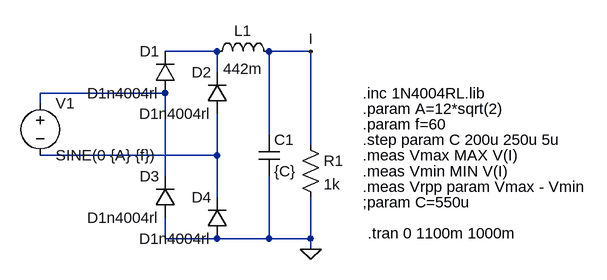
[diagram p0: schematic rectificador2_ondaCompleta.asc]
rectificador2_ondaCompleta.asc, the LTspice schematic file:
Version 4
SHEET 1 880 680
WIRE 192 -16 112 -16
WIRE 336 -16 272 -16
WIRE 192 16 192 -16
WIRE 112 48 -80 48
WIRE -80 64 -80 48
WIRE 272 112 272 -16
WIRE 336 128 336 -16
WIRE 192 144 192 80
WIRE 192 144 -80 144
WIRE 112 176 112 48
WIRE 192 208 192 144
WIRE 112 272 112 240
WIRE 192 272 112 272
WIRE 272 272 272 176
WIRE 272 272 192 272
WIRE 336 272 336 208
WIRE 336 272 272 272
WIRE 336 288 336 272
FLAG 336 288 0
FLAG 336 -16 I
SYMBOL diode 128 48 R180
WINDOW 0 24 64 Left 2
WINDOW 3 24 0 Left 2
SYMATTR InstName D1
SYMATTR Value D1n4004rl
SYMBOL voltage -80 48 R0
WINDOW 123 0 0 Left 0
WINDOW 39 0 0 Left 0
SYMATTR InstName V1
SYMATTR Value SINE(0 {A} {f})
SYMBOL cap 256 112 R0
SYMATTR InstName C1
SYMATTR Value {C}
SYMBOL res 320 112 R0
SYMATTR InstName R1
SYMATTR Value 1k
SYMBOL diode 208 80 R180
WINDOW 0 24 64 Left 2
WINDOW 3 24 0 Left 2
SYMATTR InstName D2
SYMATTR Value D1n4004rl
SYMBOL diode 128 240 R180
WINDOW 0 24 64 Left 2
WINDOW 3 24 0 Left 2
SYMATTR InstName D3
SYMATTR Value D1n4004rl
SYMBOL diode 208 272 R180
WINDOW 0 24 64 Left 2
WINDOW 3 24 0 Left 2
SYMATTR InstName D4
SYMATTR Value D1n4004rl
SYMBOL ind 176 0 R270
WINDOW 0 32 56 VTop 2
WINDOW 3 5 56 VBottom 2
SYMATTR InstName L1
SYMATTR Value 442m
TEXT 416 48 Left 2 !.inc 1N4004RL.lib
TEXT 416 72 Left 2 !.param A=12*sqrt(2)
TEXT 416 96 Left 2 !.param f=60
TEXT 416 120 Left 2 !.step param C 200u 250u 5u
TEXT 416 144 Left 2 !.meas Vmax MAX V(I)
TEXT 416 168 Left 2 !.meas Vmin MIN V(I)
TEXT 416 192 Left 2 !.meas Vrpp param Vmax - Vmin
TEXT 424 264 Left 2 !.tran 0 1100m 1000m
TEXT 416 216 Left 2 !;param C=550u

The netlist it stands for:
* rectificador2_ondaCompleta.asc
D1 N002 N001 D1n4004rl
V1 N002 N003 SINE(0 {A} {f})
C1 I 0 {C}
R1 I 0 1k
D2 N003 N001 D1n4004rl
D3 0 N002 D1n4004rl
D4 0 N003 D1n4004rl
L1 N001 I 442m
.model D D
.lib standard.dio
.inc 1N4004RL.lib
.param A=12*sqrt(2)
.param f=60
.step param C 200u 250u 5u
.meas Vmax MAX V(I)
.meas Vmin MIN V(I)
.meas Vrpp param Vmax - Vmin
.tran 0 1100m 1000m
;param C=550u
.backanno
.end